# Altium schematic sheet Supply.SchDoc: =Project
size 420 x 297 mm; Author: G.Kasprowicz; CompanyName: WUT ISE; DrawnBy: G.Kasprowicz; Organization: WUT ISE; Address1: PW ISE; Address2: Nowowiejska 15/19 00-665 Warsaw; Address3: gkasprow@gmail.com; SheetNumber: -; SheetTotal: -; ModifiedBy: -; CheckedDate: -; Title2: Power Supply; DivGrp: WUT ISE; Designer: G.Kasprowicz; SPICEModelCacheRYPVXPCY: <root> / <DocumentId>RYPVXPCY</DocumentId> / </root>; ModifiedDate: -; ProjectName: Sensor Box
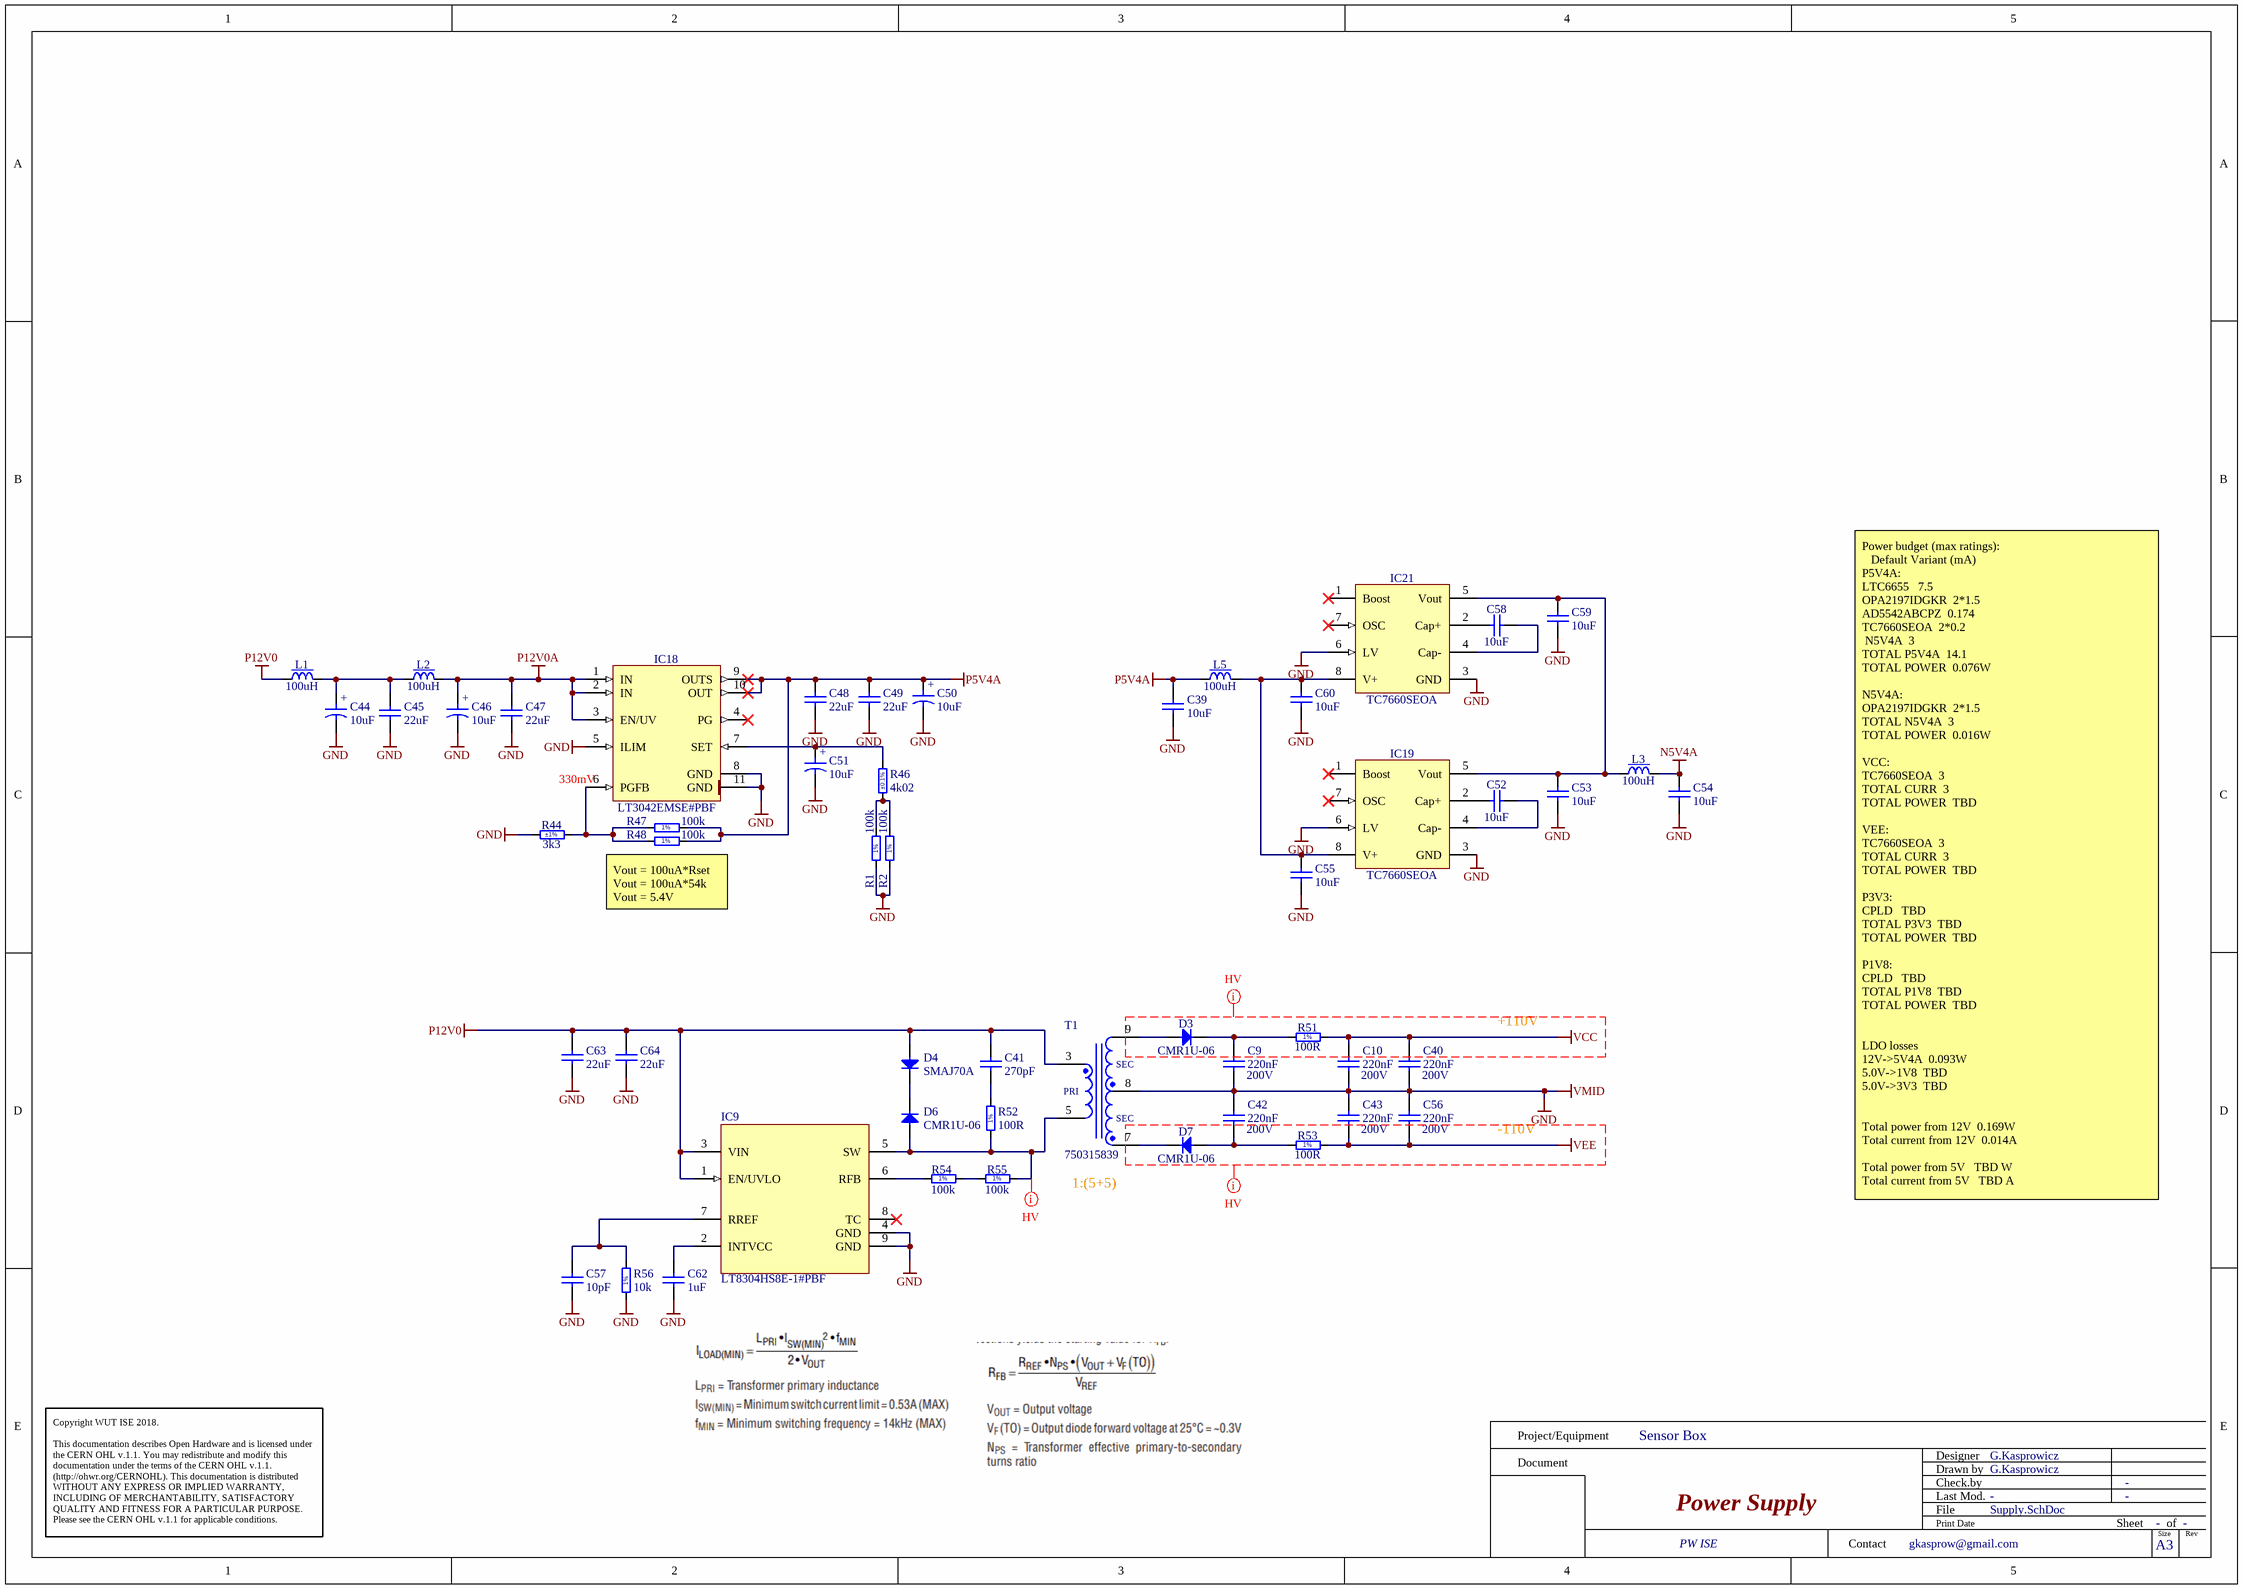
[diagram p0: Supply.SchDoc]

## Parts
C9  220nF  Voltage: 200V  [CAPC3216X140N]
C10  220nF  Voltage: 200V  [CAPC3216X140N]
C39  10uF  [CAPC1608X80N]
C40  220nF  Voltage: 200V  [CAPC3216X140N]
C41  270pF  [CAPC2013X115N]
C42  220nF  Voltage: 200V  [CAPC3216X140N]
C43  220nF  Voltage: 200V  [CAPC3216X140N]
C44  10uF  [CAPMP3216X180N]
C45  22uF  [CAPC2012X135N]
C46  10uF  [CAPMP3216X180N]
C47  22uF  [CAPC2012X135N]
C48  22uF  [CAPC2012X135N]
C49  22uF  [CAPC2012X135N]
C50  10uF  [CAPMP3216X180N]
C51  10uF  [CAPMP3216X180N]
C52  10uF  [CAPC1608X80N]
C53  10uF  [CAPC1608X80N]
C54  10uF  [CAPC1608X80N]
C55  10uF  [CAPC1608X80N]
C56  220nF  Voltage: 200V  [CAPC3216X140N]
C57  10pF  [CAPC1005X55N]
C58  10uF  [CAPC1608X80N]
C59  10uF  [CAPC1608X80N]
C60  10uF  [CAPC1608X80N]
C62  1uF  [CAPC1608X87N]
C63  22uF  [CAPC2012X135N]
C64  22uF  [CAPC2012X135N]
D3  CMR1U-06  [FP-SMA-MFG]
D4  SMAJ70A  [FP-SMA-MFG]
D6  CMR1U-06  [FP-SMA-MFG]
D7  CMR1U-06  [FP-SMA-MFG]
IC9  LT8304HS8E-1#PBF  [FP-S8E-8-05-08-1857-MFG]
IC18  LT3042EMSE#PBF  [SOP50P490X110-11N-R168X198]
IC19  TC7660SEOA  [SOIC127P600X175-8N]
IC21  TC7660SEOA  [SOIC127P600X175-8N]
L1  100uH  [INDM5650X530N]
L2  100uH  [INDM5650X530N]
L3  100uH  [INDM3225X240N]
L5  100uH  [INDM3225X240N]
R1  100k  [RESC1005X40N]
R2  100k  [RESC1005X40N]
R44  3k3  Tolerance: ±1%  [RESC1005X40N]
R46  4k02  Tolerance: ±0.1%  [RESC1608X55N]
R47  100k  [RESC1005X40N]
R48  100k  [RESC1005X40N]
R51  100R  [RESC3216X65N]
R52  100R  [RESC3216X65N]
R53  100R  [RESC3216X65N]
R54  100k  [RESC1005X40N]
R55  100k  [RESC1005X40N]
R56  10k  [RESC1005X40N]
T1  750315839  [WE-FLYLT_EP13_L13.46W17.75H12.70]

## Nets
GND: C9.1 C10.1 C39.1 C40.1 C42.2 C43.2 C44.2 C45.1 C46.2 C47.1 C48.1 C49.1 C50.2 C51.2 C53.1 C54.1 C55.1 C56.2 C57.1 C59.1 C60.1 C62.1 C63.1 C64.1 IC9.4(GND) IC9.9(GND) IC18.5(ILIM) IC18.8(GND) IC18.11(GND) IC19.3(GND) IC19.6(LV) IC21.3(GND) IC21.6(LV) R1.2 R2.2 R44.2 R56.1 T1.8  [also labelled VMID]
N5V4A: C54.2 L3.2
P5V4A: C39.2 C48.2 C49.2 C50.1 IC18.9(OUTS) IC18.10(OUT) L5.1 R47.1 R48.1
P12V0: C41.2 C63.2 C64.2 D4.2(A) IC9.1(EN/UVLO) IC9.3(VIN) L1.1 T1.3
P12V0A: C46.1 C47.2 IC18.1(IN) IC18.2(IN) IC18.3(EN/UV) L2.2
VCC: C10.2 C40.2 R51.2
VEE: C43.1 C56.1 R53.2
NetC9_2: C9.2 D3.1(C) R51.1
NetC41_1: C41.1 R52.2
NetC42_1: C42.1 D7.2(A) R53.1
NetC44_1: C44.1 C45.2 L1.2 L2.1
NetC51_1: C51.1 IC18.7(SET) R46.2
NetC52_1: C52.1 IC19.2(Cap+)
NetC52_2: C52.2 IC19.4(Cap-)
NetC53_2: C53.2 C59.2 IC19.5(Vout) IC21.5(Vout) L3.1
NetC55_2: C55.2 C60.2 IC19.8(V+) IC21.8(V+) L5.2
NetC57_2: C57.2 IC9.7(RREF) R56.2
NetC58_1: C58.1 IC21.2(Cap+)
NetC58_2: C58.2 IC21.4(Cap-)
NetC62_2: C62.2 IC9.2(INTVCC)
NetD3_2: D3.2(A) T1.9
NetD4_1: D4.1(C) D6.1(C)
NetD6_2: D6.2(A) IC9.5(SW) R52.1 R55.1 T1.5
NetD7_1: D7.1(C) T1.7
NetIC9_6: IC9.6(RFB) R54.2
NetIC18_6: IC18.6(PGFB) R44.1 R47.2 R48.2
NetR1_1: R1.1 R2.1 R46.1
NetR54_1: R54.1 R55.2

Not connected (* = marked no-connect by the designer): IC9 8(TC)*; IC18 4(PG)*; IC19 1(Boost)* 7(OSC)*; IC21 1(Boost)* 7(OSC)*

## Layout directives
net class HV: NetD6_2, VCC, VEE

## Notes on the sheet
- (near IC18) 330mV
- (near R48) Vout = 100uA*Rset
  Vout = 100uA*54k
  Vout = 5.4V
- +110V
- -110V
- (near T1) 1:(5+5)
- Power budget (max ratings):
  Default Variant (mA)
  P5V4A:
  LTC6655			7.5
  OPA2197IDGKR		2*1.5
  AD5542ABCPZ		0.174
  TC7660SEOA		2*0.2
  N5V4A		3
  TOTAL P5V4A		14.1
  TOTAL POWER		0.076W
  N5V4A:
  OPA2197IDGKR		2*1.5
  TOTAL N5V4A		3
  TOTAL POWER		0.016W
  VCC:
  TC7660SEOA		3
  TOTAL CURR		3
  TOTAL POWER		TBD
  VEE:
  TC7660SEOA		3
  TOTAL CURR		3
  TOTAL POWER		TBD
  P3V3:
  CPLD			TBD
  TOTAL P3V3		TBD
  TOTAL POWER		TBD
  P1V8:
  CPLD			TBD
  TOTAL P1V8		TBD
  TOTAL POWER		TBD
  LDO losses
  12V->5V4A		0.093W
  5.0V->1V8		TBD
  5.0V->3V3		TBD
  Total power from 12V 	0.169W
  Total current from 12V 	0.014A
  Total power from 5V 		TBD W
  Total current from 5V 		TBD A
- Project/Equipment
- Document
- Designer
- Drawn by
- Check.by
- Copyright WUT ISE 2018.
  This documentation describes Open Hardware and is licensed under the CERN OHL v.1.1. You may redistribute and modify this documentation under the terms of the CERN OHL v.1.1. (http://ohwr.org/CERNOHL). This documentation is distributed WITHOUT ANY EXPRESS OR IMPLIED WARRANTY, INCLUDING OF MERCHANTABILITY, SATISFACTORY QUALITY AND FITNESS FOR A PARTICULAR PURPOSE. Please see the CERN OHL v.1.1 for applicable conditions.
- Contact
- File
- Last Mod.
- Print Date
- Sheet
- Size
- A3
- of
- Rev
- (in symbol 750315839) SEC; PRI
- (in symbol CTE3216-18_10UF_16V_20%_AVX_TCJ) +
- (in symbol R0402_10K_1%_0.0625W_100PPM) 1%
- (in symbol R0402_100K_1%_0.0625W_100PPM) 1%
- (in symbol R1206_100R_1%_0.5W_100PPM) 1%

## Library data of the parts
C9 C10 C40 C42 C43 C56 = CC1206_220NF_250V_10%_X7R: Non-polarised capacitor; Part Description: SMD Ceramic Chip Capacitor; Manufacturer: GENERIC; Manufacturer1 Part Number: C1206C224K2RACTU; TC: X7R; Tolerance: ±10%; Part Number: CC1206_220NF_250V_10%_X7R; Component Kind: Standard; Component Type: Standard; Pin Count: 2; Value: 220nF; Status: None; Manufacturer Part Number: CC1206_220NF_250V_10%_X7R; Case: 1206; Mounted: Yes; Socket: No; SMD: Yes; Sense: No; Manufacturer1 Example: KEMET; Manufacturer1 ComponentHeight: 1.4mm; HelpURL: \\cern.ch\dfs\Applications\Altium\Datasheets\CC1206_X7R_KEMET.pdf; Author: CERN DEM JLC; CreateDate: 16/09/2009; LatestRevisionDate: 16/09/2009
C39 C52-C55 C58-C60 = CC0603_10UF_10V_10%_X5R: Non-polarised capacitor; Part Description: SMD Multilayer Chip Ceramic Capacitor; Manufacturer: GENERIC; Manufacturer1 Part Number: GRM188R61A106KE69D; Voltage: 10V; TC: X5R; Tolerance: ±10%; Part Number: CC0603_10UF_10V_10%_X5R; Component Kind: Standard; Component Type: Standard; Pin Count: 2; Value: 10uF; Status: None; Manufacturer Part Number: CC0603_10UF_10V_10%_X5R; Case: 0603; Mounted: Yes; Socket: No; SMD: Yes; Sense: No; Manufacturer1 Example: MURATA; Manufacturer1 ComponentHeight: 0.8mm; HelpURL: \\cern.ch\dfs\Applications\Altium\Datasheets\CC0603_MURATA_GRM188R61A106KE69D.pdf; Author: CERN DEM JLC; CreateDate: 31.01.2017; LatestRevisionDate: 31.01.2017
C41 = CC0805_270PF_100V_5%_C0G: Non-polarised capacitor; Part Description: Multilayer Ceramic Capacitors MLCC - SMD/SMT 2 pF 250 VDC 0.25 pF 0805 C0G (NP0); Manufacturer: Kemet; Manufacturer Part Number: C0805C271J5GAC7210; Voltage: 100V; TC: C0G/NP0; Tolerance: ±5%; Part Number: CC0805_270PF_100V_5%_C0G; Component Kind: Standard; Component Type: Standard; Pin Count: 2; Value: 270pF; Status: None; Mounted: Yes; Socket: No; SMD: Yes; Sense: No; ComponentHeight: 1.14mm; HelpURL: \\cern.ch\dfs\Applications\Altium\Datasheets\CC0805_C0G_AVX_U.pdf; Author: CERN DEM JLC; CreateDate: 27/01/2015; LatestRevisionDate: 13/03/2018; Case: 0805
C44 C46 C50 C51 = CTE3216-18_10UF_16V_20%_AVX_TCJ: Polarised capacitor; Part Description: ESR 0R200 Tantalum Solid Electrolytic Chip Capacitor with Conductive Polymer Electrode; Manufacturer: AVX; Manufacturer Part Number: TCJA106M016R0200; Voltage: 16V; Tolerance: ±20%; Part Number: CTE3216-18_10UF_16V_20%_AVX_TCJ; Component Kind: Standard; Component Type: Standard; Pin Count: 2; Value: 10uF; Status: Preferred; Case: A; Mounted: Yes; Socket: No; SMD: Yes; Sense: No; ComponentHeight: 1.8mm; HelpURL: \\cern.ch\dfs\Applications\Altium\Datasheets\CTE_AVX_TCJ.pdf; Author: CERN DEM JLC; CreateDate: 29.03.2012; LatestRevisionDate: 29.03.2012
C45 C47-C49 C63 C64 = CC0805_22UF_16V_10%_X5R: Non-polarised capacitor; Part Description: SMD Multilayer Chip Ceramic Capacitor; Manufacturer: GENERIC; Manufacturer1 Part Number: C2012X5R1C226KT; Voltage: 16V; TC: X5R; Tolerance: ±10%; Part Number: CC0805_22UF_16V_10%_X5R; Component Kind: Standard; Component Type: Standard; Pin Count: 2; Value: 22uF; Status: Preferred; Manufacturer Part Number: CC0805_22UF_16V_10%_X5R; Case: 0805; Mounted: Yes; Socket: No; SMD: Yes; Sense: No; Manufacturer1 Example: TDK; Manufacturer1 ComponentHeight: 1.35mm; HelpURL: \\cern.ch\dfs\Applications\Altium\Datasheets\CC0805_X5R_TDK_C.pdf; Author: CERN DEM JLC; CreateDate: 25.10.2012; LatestRevisionDate: 25.10.2012
C57 = CC0402_10PF_50V_5%_C0G: Non-polarised capacitor; Part Description: SMD Multilayer Chip Ceramic Capacitor; Manufacturer: GENERIC; Manufacturer1 Part Number: C0402C100J5GACTU; Voltage: 50V; TC: C0G/NP0; Tolerance: ±5%; Part Number: CC0402_10PF_50V_5%_C0G; Component Kind: Standard; Component Type: Standard; Pin Count: 2; Value: 10pF; Status: Preferred; Manufacturer Part Number: CC0402_10PF_50V_5%_C0G; Case: 0402; Mounted: Yes; Socket: No; SMD: Yes; Sense: No; Manufacturer1 Example: KEMET; Manufacturer1 ComponentHeight: 0.55mm; HelpURL: \\cern.ch\dfs\Applications\Altium\Datasheets\CC0805_C0G_KEMET_(Commercial Grade).pdf; Author: CERN DEM JLC; CreateDate: 03.12.2007; LatestRevisionDate: 22.04.2015
C62 = CC0603_1UF_25V_10%_X7R: Non-polarised capacitor; Part Description: SMD Multilayer Chip Ceramic Capacitor; Manufacturer: GENERIC; Manufacturer1 Part Number: GCM188R71E105KA64D; Voltage: 25V; TC: X7R; Tolerance: ±10%; Part Number: CC0603_1UF_25V_10%_X7R; Component Kind: Standard; Component Type: Standard; Pin Count: 2; Value: 1uF; Status: None; Manufacturer Part Number: CC0603_1UF_25V_10%_X7R; Case: 0603; Mounted: Yes; Socket: No; SMD: Yes; Sense: No; Manufacturer1 Example: MURATA; Manufacturer1 ComponentHeight: 0.9mm; HelpURL: \\cern.ch\dfs\Applications\Altium\Datasheets\CC0603_X7R_MURATA.pdf; Author: CERN DEM JLC; CreateDate: 18.01.2011; LatestRevisionDate: 18.01.2011
D3 D6 D7 = CMR1U-06: Diode; Part Description: Ultra Fast Recovery Rectifiers; Manufacturer: Central Semiconductor; Voltage: 600V; PressFit: No; Bonding: No; Part Number: CMR1U-06; Component Kind: Standard; Component Type: Standard; Device: CMR1U-06; Footprint: SMA; Manufacturer Part Number: CMR1U-06; Pin Count: 2; Case: SMA; Mounted: Yes; Socket: No; SMD: Yes; Sense: No; ComponentHeight: 2.92mm; HelpURL: \\cern.ch\dfs\Applications\Altium\Datasheets\SMBJ.pdf; Author: CERN DEM JLC; CreateDate: 08.12.2008; LatestRevisionDate: 19.12.2011
D4 = SMAJ70A: Diode; Part Description: ESD Protection Diodes / TVS Diodes 400W 70V 5% Uni-Directional; Manufacturer: Littlelfuse; Voltage: 70V; Power: 400W; PressFit: No; Bonding: No; Part Number: SMAJ70A; Component Kind: Standard; Component Type: Standard; Device: SMAJ70A; Footprint: SMA; Manufacturer Part Number: SMAJ70A; Pin Count: 2; Case: DO-214AC-2; Mounted: Yes; Socket: No; SMD: Yes; Sense: No; ComponentHeight: 2.65mm; HelpURL: \\cern.ch\dfs\Applications\Altium\Datasheets\SMBJ.pdf; Author: CERN DEM JLC; CreateDate: 08.12.2008; LatestRevisionDate: 19.12.2011
IC9 = LT8304HS8E-1#PBF: IC REG FLYBACK ADJ 2A 8SOIC; Manufacturer: Analog Devices; RoHS Compliant: Yes; Manufacturer Part Number: LT8304HS8E-1#PBF; Part Number: LT8304HS8E-1#PBF
IC18 = LT3042EMSE#PBF: 20V, 200mA, Ultralow Noise, Ultrahigh PSRR RF Linear Regulator; Manufacturer: LINEAR TECHNOLOGY; PressFit: No; Bonding: No; Part Number: LT3042EMSE#PBF; Component Kind: Standard; Component Type: Standard; Device: LT3042EMSE#PBF; PackageDescription: SOP, 0.50mm, Pitch; 10 pin, 3.00mm W X 3.00mm L X 1.10mm H body (w/thermal tab  1.68 X 1.98 mm), IPC Medium Density; Part Description: 20V, 200mA, Ultralow Noise, Ultrahigh PSRR RF Linear Regulator; Manufacturer Part Number: LT3042EMSE#PBF; Pin Count: 11; Case: MSOP10; Mounted: Yes; Socket: No; SMD: Yes; Sense: No; ComponentHeight: 1.1mm; HelpURL: \\cern.ch\dfs\Applications\Altium\Datasheets\LT3042EMSE#PBF.pdf; Author: CERN DEM MR; CreateDate: 09.06.2016; LatestRevisionDate: 09.06.2016
IC19 IC21 = TC7660SEOA: Super Charge Pump DC-to-DC Voltage Converter; Manufacturer: MICROCHIP TECHNOLOGY; PressFit: No; Bonding: No; Part Number: TC7660SEOA; Component Kind: Standard; Component Type: Standard; Device: TC7660SEOA; PackageDescription: SOIC 8, Pitch 1.27mm, Body 4x5mm, IPC Medium Density; Part Description: Super Charge Pump DC-to-DC Voltage Converter; Manufacturer Part Number: TC7660SEOA; Pin Count: 8; Case: SOIC8; Mounted: Yes; Socket: No; SMD: Yes; Sense: No; ComponentHeight: 1.75mm; HelpURL: \\cern.ch\dfs\Applications\Altium\Datasheets\TC7660S.pdf; Author: CERN DEM HF; CreateDate: 28.02.2024; LatestRevisionDate: 28.02.2024
L1 L2 = IND2220_100UH_10%_EPCOS_B82442H: Inductor With Core; Part Description: SMT Inductor SIMID Series; Manufacturer: EPCOS; Manufacturer Part Number: B82442H1104K000; Power: 350mA; Resistance: 1.28R; Tolerance: ±10%; Part Number: IND2220_100UH_10%_EPCOS_B82442H; Component Kind: Standard; Component Type: Standard; Pin Count: 2; Value: 100uH; Case: 2220; Mounted: Yes; Socket: No; SMD: Yes; Sense: No; ComponentHeight: 5.3mm; HelpURL: \\cern.ch\dfs\Applications\Altium\Datasheets\IND2220_EPCOS_B82442H.pdf; Author: CERN DEM JLC; CreateDate: 03.10.2011; LatestRevisionDate: 03.10.2011
L3 L5 = IND1210_100UH_10%_EPCOS_B82422H: Inductor With Core; Part Description: SMT Inductor SIMID Series; Manufacturer: EPCOS; Manufacturer Part Number: B82422H1104K000; Power: 150mA; Resistance: 4.8R; Tolerance: ±10%; Part Number: IND1210_100UH_10%_EPCOS_B82422H; Component Kind: Standard; Component Type: Standard; Pin Count: 2; Value: 100uH; Case: 1210; Mounted: Yes; Socket: No; SMD: Yes; Sense: No; ComponentHeight: 2.4mm; HelpURL: \\cern.ch\dfs\Applications\Altium\Datasheets\IND1210_EPCOS_B82422H.pdf; Author: CERN DEM JLC; CreateDate: 04.06.2012; LatestRevisionDate: 04.06.2012
R1 R2 R47 R48 R54 R55 = R0402_100K_1%_0.0625W_100PPM: Resistor - 1%; Part Description: General Purpose Thick Film Chip Resistor; Manufacturer: GENERIC; Manufacturer1 Part Number: 232270671004L; PressFit: No; TC: ±100ppm/°C; Part Number: R0402_100K_1%_0.0625W_100PPM; Component Kind: Standard; Component Type: Standard; Pin Count: 2; Value: 100k; Status: Not Recommended; Manufacturer Part Number: R0402_100K_1%_0.0625W_100PPM; Case: 0402; Mounted: Yes; Sense: No; Socket: No; SMD: Yes; Manufacturer1 Example: YAGEO PHYCOMP; Manufacturer1 ComponentHeight: 0.4mm; HelpURL: \\cern.ch\dfs\Applications\Altium\Datasheets\R0402_Phycomp_RC0402.pdf; Author: CERN DEM JLC; CreateDate: 03.12.2007; LatestRevisionDate: 17.10.2012; Power: 0.0625W; Tolerance: ±1%
R44 = R0402_3K3_1%_0.0625W_100PPM: Resistor - 1%; Part Description: General Purpose Thick Film Chip Resistor; Manufacturer: GENERIC; Manufacturer1 Part Number: 232270673302L; TC: ±100ppm/°C; PressFit: No; Part Number: R0402_3K3_1%_0.0625W_100PPM; Component Kind: Standard; Component Type: Standard; Pin Count: 2; Value: 3k3; Status: Not Recommended; Power: 0.0625W; Manufacturer Part Number: R0402_3K3_1%_0.0625W_100PPM; Case: 0402; Mounted: Yes; Sense: No; Socket: No; SMD: Yes; Manufacturer1 Example: YAGEO PHYCOMP; Manufacturer1 ComponentHeight: 0.4mm; HelpURL: \\cern.ch\dfs\Applications\Altium\Datasheets\R0402_Phycomp_RC0402.pdf; Author: CERN DEM JLC; CreateDate: 03.12.2007; LatestRevisionDate: 17.10.2012
R46 = R0603_4K02_0.1%_0.063W_10PPM_1: Resistor - 0.1%; Part Description: Thin Film Chip Resistor; Manufacturer: GENERIC; Manufacturer1: Panasonic; Manufacturer1 Part Number: ERA-3ARB4021V; Power: 0.063W; TC: ±10ppm; PressFit: No; Part Number: R0603_4K02_0.1%_0.063W_10PPM; Component Kind: Standard; Component Type: Standard; Pin Count: 2; Value: 4k02; Status: Not Recommended; Manufacturer Part Number: R0603_4K02_0.1%_0.063W_10PPM; Case: 0603; Mounted: Yes; Sense: No; Socket: No; SMD: Yes; Manufacturer1 ComponentHeight: 0.55mm; HelpURL: \\cern.ch\dfs\Applications\Altium\Datasheets\R0603_Tyco_RN73.pdf; Author: CERN DEM BC; CreateDate: 23.05.2016; LatestRevisionDate: 23.05.2016
R51-R53 = R1206_100R_1%_0.5W_100PPM: Resistor - 1%; Part Description: General Purpose Thick Film Chip Resistor; Manufacturer: GENERIC; Manufacturer1 Part Number: CRS1206-FX-1000ELF; Power: 0.5W; TC: ±100ppm/°C; PressFit: No; Part Number: R1206_100R_1%_0.5W_100PPM; Component Kind: Standard; Component Type: Standard; Pin Count: 2; Value: 100R; Status: Preferred; Tolerance: ±1%; Manufacturer Part Number: R1206_100R_1%_0.5W_100PPM; Mounted: Yes; Sense: No; Socket: No; SMD: Yes; Manufacturer1 Example: Bourns; Manufacturer1 ComponentHeight: 0.65mm; HelpURL: \\cern.ch\dfs\Applications\Altium\Datasheets\R1206_NIC_NRC.pdf; Author: CERN DEM JLC; CreateDate: 03/12/2007; LatestRevisionDate: 13/03/2008; Case: 1206
R56 = R0402_10K_1%_0.0625W_100PPM: Resistor - 1%; Part Description: General Purpose Thick Film Chip Resistor; Manufacturer: GENERIC; Manufacturer1 Part Number: 232270671003L; TC: ±100ppm/°C; PressFit: No; Part Number: R0402_10K_1%_0.0625W_100PPM; Component Kind: Standard; Component Type: Standard; Pin Count: 2; Value: 10k; Status: Not Recommended; Power: 0.0625W; Tolerance: ±1%; Manufacturer Part Number: R0402_10K_1%_0.0625W_100PPM; Case: 0402; Mounted: Yes; Sense: No; Socket: No; SMD: Yes; Manufacturer1 Example: YAGEO PHYCOMP; Manufacturer1 ComponentHeight: 0.4mm; HelpURL: \\cern.ch\dfs\Applications\Altium\Datasheets\R0402_Phycomp_RC0402.pdf; Author: CERN DEM JLC; CreateDate: 03.12.2007; LatestRevisionDate: 17.10.2012
T1 = 750315839: 750315839 Flyback Transformer EP13 SMT; Ui; Manufacturer: Wurth Elektronik; Part Number: 750315839; Manufacturer Part Number: 750315839